# EAGLE design ATTiny_T1 (EAGLE 4.16)
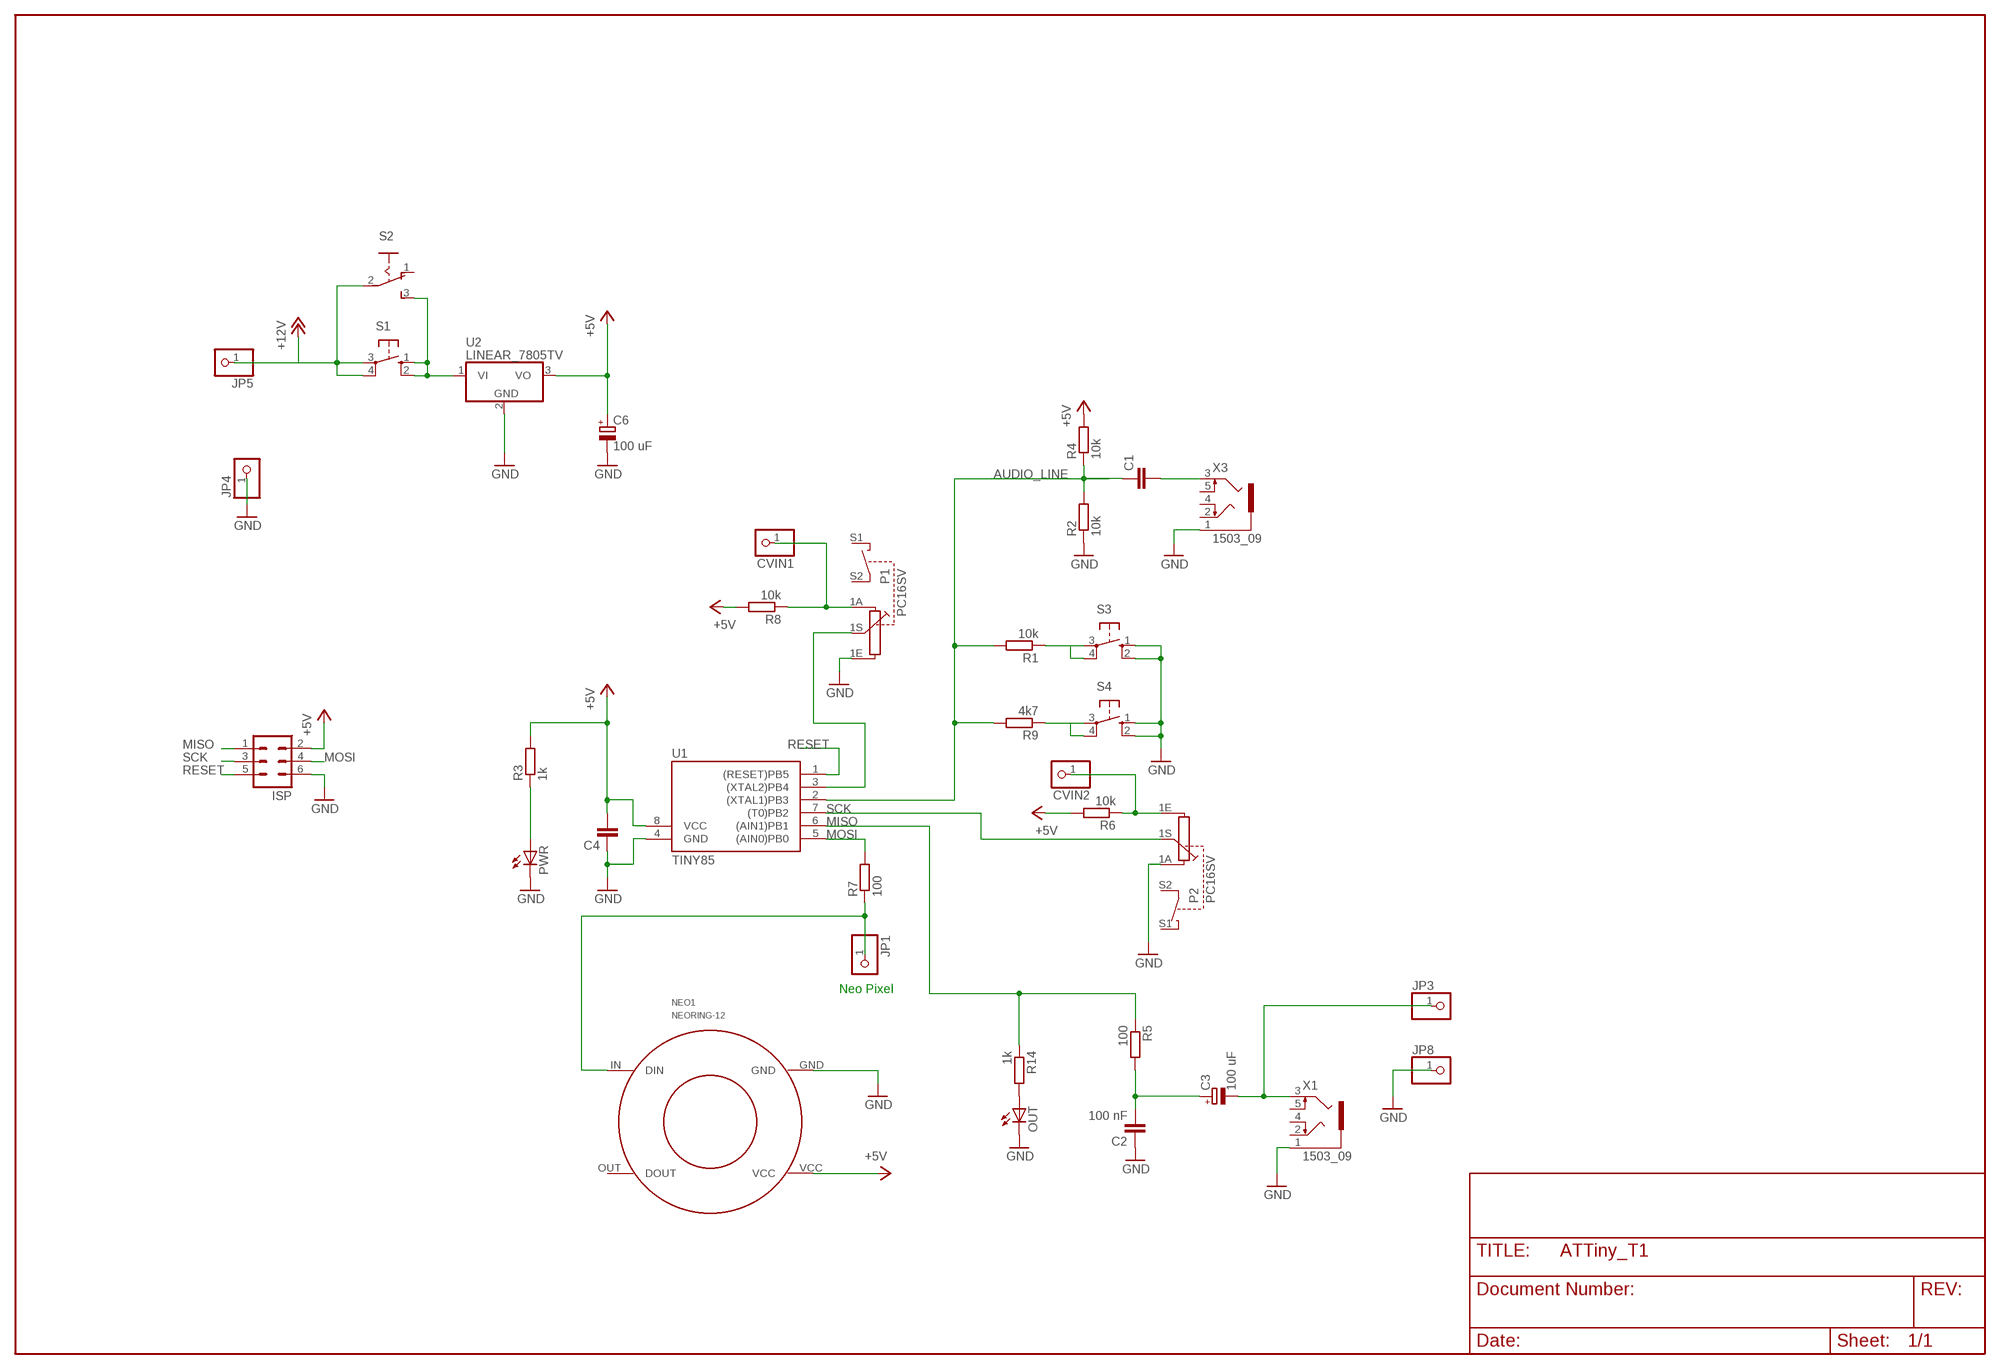
[diagram p0: schematic, sheet 1]

## Parts
C1  RCL_C-EU025-025X050  [RCL_C025-025X050]
C2  100 nF  RCL_C-EU025-025X050  [RCL_C025-025X050]
C3  100 uF  RCL_CPOL-EUE5-8.5  [RCL_E5-8,5]
C4  RCL_C-EU025-025X050  [RCL_C025-025X050]
C6  100 uF  RCL_CPOL-EUE5-8.5  [RCL_E5-8,5]
CVIN1  PINHEAD_PINHD-1X1  [PINHEAD_1X01]
CVIN2  PINHEAD_PINHD-1X1  [PINHEAD_1X01]
ISP  MA03-2  [MA03-2]
JP1  PINHEAD_PINHD-1X1  [PINHEAD_1X01]
JP3  PINHEAD_PINHD-1X1  [PINHEAD_1X01]
JP4  PINHEAD_PINHD-1X1  [PINHEAD_1X01]
JP5  PINHEAD_PINHD-1X1  [PINHEAD_1X01]
JP8  PINHEAD_PINHD-1X1  [PINHEAD_1X01]
NEO1  NEORING-12  [NEORING-12]
OUT  LED_LED3MM  [LED_LED3MM]
P1  PC16SV  [PC16SV]
P2  PC16SV  [PC16SV]
PWR  LED_LED3MM  [LED_LED3MM]
R1  10k  RCL_R-EU_0207/10  [RCL_0207/10]
R2  10k  RCL_R-EU_0207/10  [RCL_0207/10]
R3  1k  RCL_R-EU_0207/10  [RCL_0207/10]
R4  10k  RCL_R-EU_0207/10  [RCL_0207/10]
R5  100  RCL_R-EU_0207/10  [RCL_0207/10]
R6  10k  RCL_R-EU_0207/10  [RCL_0207/10]
R7  100  RCL_R-EU_0207/10  [RCL_0207/10]
R8  10k  RCL_R-EU_0207/10  [RCL_0207/10]
R9  4k7  RCL_R-EU_0207/10  [RCL_0207/10]
R14  1k  RCL_R-EU_0207/10  [RCL_0207/10]
S1  SWITCH-OMRON_10-XX  [SWITCH-OMRON_B3F-10XX]
S2  SWITCH_255SB  [SWITCH_255SB]
S3  SWITCH-OMRON_10-XX  [SWITCH-OMRON_B3F-10XX]
S4  SWITCH-OMRON_10-XX  [SWITCH-OMRON_B3F-10XX]
U1  TINY85  [DIL08]
U2  LINEAR_7805TV  [LINEAR_TO220V]
X1  1503_09  [1503_09]
X3  1503_09  [1503_09]

## Nets
+5V: C4.2 C6.+ ISP.2 NEO1.VCC R3.2 R4.2 R6.2 R8.2 U1.8(VCC) U2.3(VO)
+12V: JP5.1 S1.3(P) S1.4(P1) S2.2(P)
AUDIO_LINE: C1.1 R1.2 R2.2 R4.1 R9.2 U1.2((XTAL1)PB3)
CVIN1: CVIN2.1 P2.1E R6.1
CVIN2: CVIN1.1 P1.1A R8.1
GND: C2.1 C4.1 C6.- ISP.6 JP4.1 JP8.1 NEO1.GND OUT.K(C) P1.1E P2.1A PWR.K(C) R2.1 S3.1(S) S3.2(S1) S4.1(S) S4.2(S1) U1.4(GND) U2.2(GND) X1.1 X3.1
MISO: ISP.1 R5.1 R14.1 U1.6((AIN1)PB1)
MOSI: ISP.4 R7.2 U1.5((AIN0)PB0)
N$4: JP1.1 NEO1.IN(DIN) R7.1
N$6: R1.1 S3.3(P) S3.4(P1)
N$7: S1.1(S) S1.2(S1) S2.3(S) U2.1(VI)
N$8: R9.1 S4.3(P) S4.4(P1)
N$10: PWR.A R3.1
N$12: OUT.A R14.2
N$13: C2.2 C3.+ R5.2
N$14: C3.- JP3.1 X1.3
N$17: P1.1S U1.3((XTAL2)PB4)
N$22: C1.2 X3.3
RESET: ISP.5 U1.1((RESET)PB5)
SCK: ISP.3 P2.1S U1.7((T0)PB2)
Unconnected: NEO1.OUT(DOUT) P1.S1 P1.S2 P2.S1 P2.S2 S2.1(O) X1.2 X1.4 X1.5 X3.2 X3.4 X3.5

## Notes on the sheet
- Neo Pixel

## Library data of the parts
C1 C2 C4 = libarduinorobot:RCL_C-EU: CAPACITOR, European symbol
C3 C6 = libarduinorobot:RCL_CPOL-EU: POLARIZED CAPACITOR, European symbol
CVIN1 CVIN2 JP1 JP3-JP5 JP8 = libarduinorobot:PINHEAD_PINHD-1X1: PIN HEADER
ISP = con-lstb:MA03-2: PIN HEADER
NEO1 = NeoPixel:NEORING-12
OUT PWR = libarduinorobot:LED_LED: LED OSRAM: - CHIPLED LG R971, LG N971, LY N971, LG Q971, LY Q971, LO R971, LY R971 LH N974, LH R974 LS Q976, LO Q976, LY Q976 LO Q996 - Hyper CHIPLED LW Q18S LB Q993, LB Q99A, LB R99A - SideLED LS A670, LO A670, LY A670, LG A670, LP A670 LB A673, LV A673, LT A673, LW A673 LH A674 LY A675 LS A676, LA A676, LO A676, LY A676, LW A676 LS A679, LY A679, LG A679 - Hyper Micro SIDELED® LS Y876, LA Y876, LO Y876, LY Y876 LT Y87S - SmartLED LW L88C, LW L88S LB L89C, LB L89S, LG L890 LS L89K, LO L89K, LY L89K LS L896, LA L896, LO L896, LY L896 - TOPLED LS T670, LO T670, LY T670, LG T670, LP T670 LSG T670, LSP T670, LSY T670, LOP T670, LYG T670 LG T671, LOG T671, LSG T671 LB T673, LV T673, LT T673, LW T673 LH T674 LS T676, LA T676, LO T676, LY T676, LB T676, LH T676, LSB T676, LW T676 LB T67C, LV T67C, LT T67C, LS T67K, LO T67K, LY T67K, LW E67C LS E67B, LA E67B, LO E67B, LY E67B, LB E67C, LV E67C, LT E67C LW T67C LS T679, LY T679, LG T679 LS T770, LO T770, LY T770, LG T770, LP T770 LB T773, LV T773, LT T773, LW T773 LH T774 LS E675, LA E675, LY E675, LS T675 LS T776, LA T776, LO T776, LY T776, LB T776 LHGB T686 LT T68C, LB T68C - Hyper Mini TOPLED® LB M676 - Mini TOPLED Santana® LG M470 LS M47K, LO M47K, LY M47K Source: http://www.osram.convergy.de LUXEON: - LUMILED® LXK2-PW12-R00, LXK2-PW12-S00, LXK2-PW14-U00, LXK2-PW14-V00 LXK2-PM12-R00, LXK2-PM12-S00, LXK2-PM14-U00 LXK2-PE12-Q00, LXK2-PE12-R00, LXK2-PE12-S00, LXK2-PE14-T00, LXK2-PE14-U00 LXK2-PB12-K00, LXK2-PB12-L00, LXK2-PB12-M00, LXK2-PB14-N00, LXK2-PB14-P00, LXK2-PB14-Q00 LXK2-PR12-L00, LXK2-PR12-M00, LXK2-PR14-Q00, LXK2-PR14-R00 LXK2-PD12-Q00, LXK2-PD12-R00, LXK2-PD12-S00 LXK2-PH12-R00, LXK2-PH12-S00 LXK2-PL12-P00, LXK2-PL12-Q00, LXK2-PL12-R00 Source: www.luxeon.com KINGBRIGHT: KA-3528ASYC Source: www.kingbright.com
P1 P2 = piher:PC16SV: POTENTIOMETER vertical single carbon potentiometer with switch, 16 mm
R1-R9 R14 = libarduinorobot:RCL_R-EU_: RESISTOR, European symbol
S1 S3 S4 = libarduinorobot:SWITCH-OMRON_10-XX: OMRON SWITCH
S2 = libarduinorobot:SWITCH_255SB: SLIDING SWITCH Distributor Buerklin, 11G810
U1 = atmel:TINY85
U2 = libarduinorobot:LINEAR_78*: Positive VOLTAGE REGULATOR Source: http://cache.national.com/ds/LM/LM78L05.pdf http://www.fairchildsemi.com/ds/LM/LM7805.pdf
X1 X3 = con-lumberg:1503_09: Jack connectors according to JISC 6560, 3.5 mm Klinkeneinbaukupplung nach JISC 6560, 3,5 mm, 3-polig/ stereo, abgewinkelte Ausführung, mit 2 Öffnern und Lötaugen, für Leiterplatten Rückseitenmontage Source: http://www.lumberg.com/Produkte/PDFs/1503_09.pdf

## Board
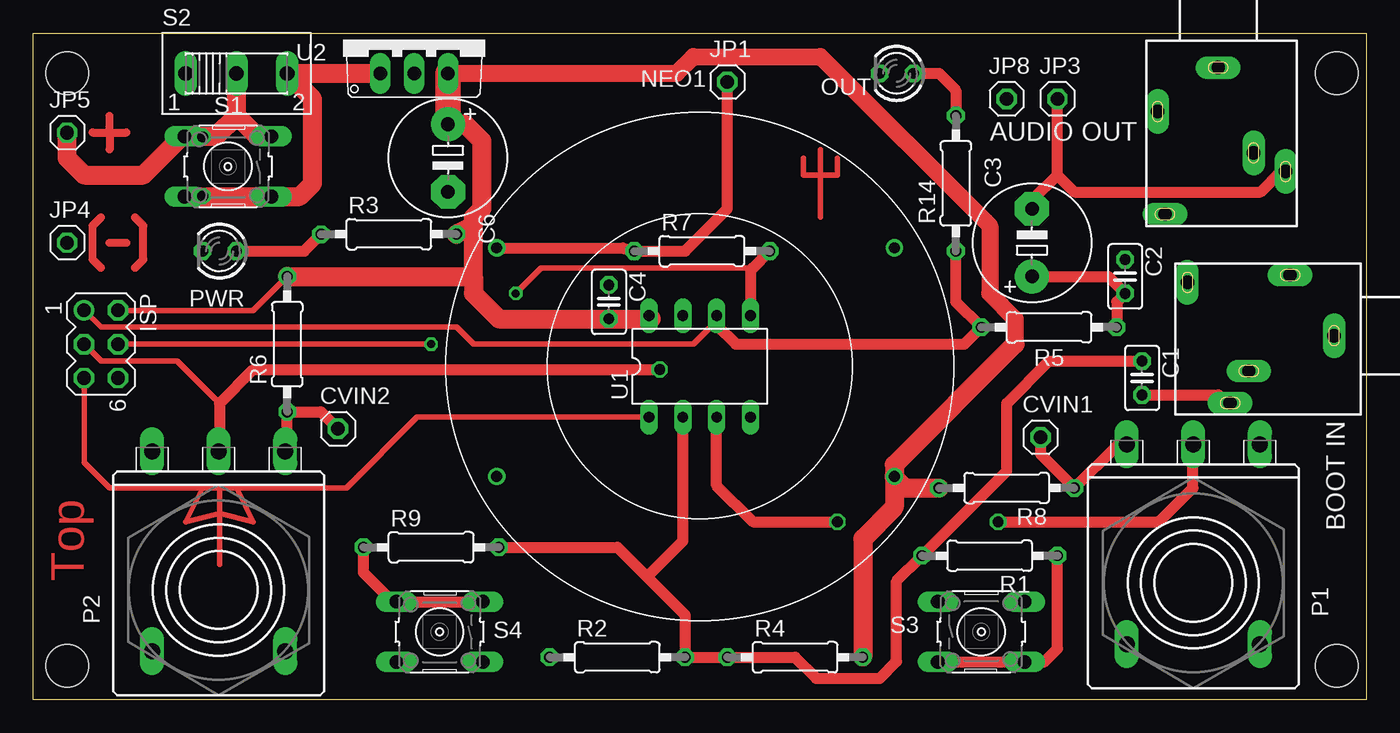
[diagram p1: board, top side]
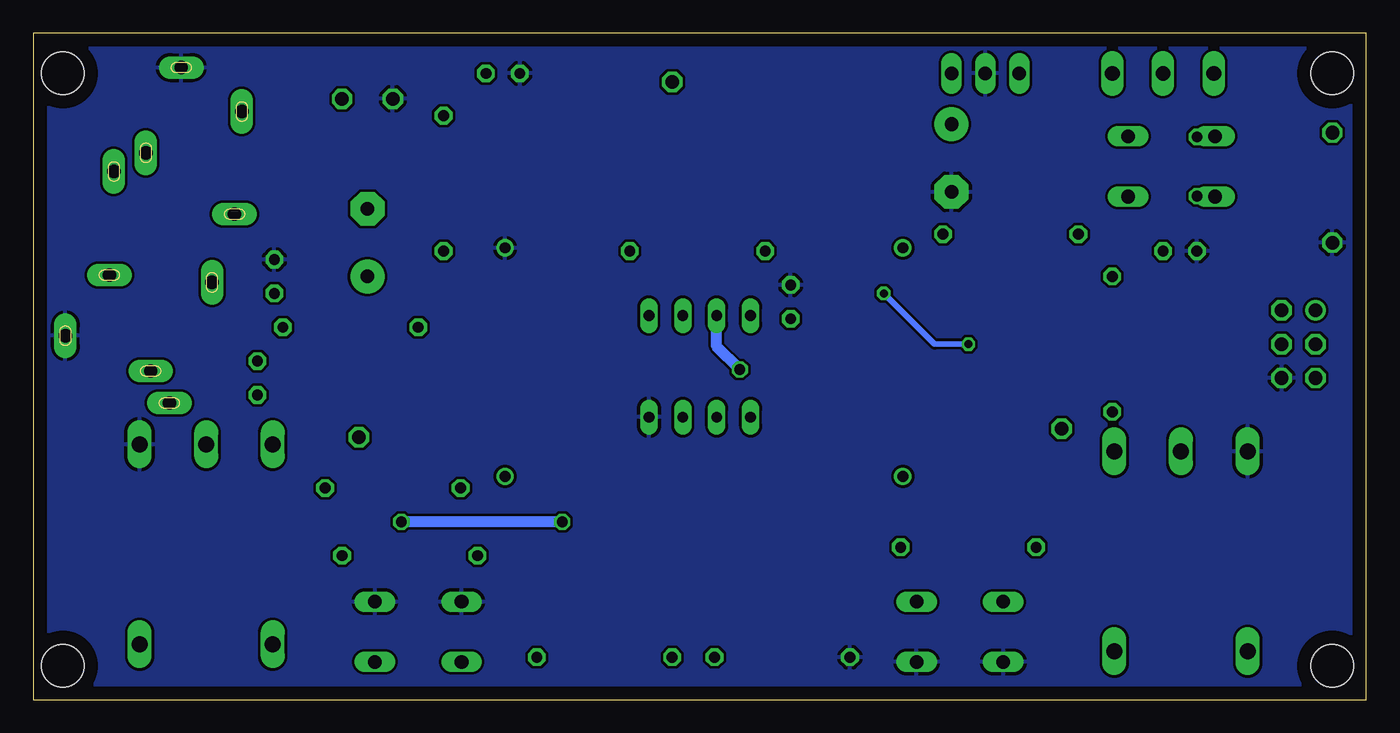
[diagram p2: board, bottom side, seen from below]

Size 100 x 50 mm. Coordinates in mm from the lower left corner, seen from the top.
Outline: 0,0 0,50 100,50 100,0 0,0
Copper layers (1+16): Top 0.035mm / dielectric 1.5mm / Bottom 0.035mm
Design rules "dru0_2mm": minimum track width 0.2mm, minimum drill 0.3mm, track to track 0.2mm, track to pad 0.2mm, pad to pad 0.2mm, via to via 0.2mm, smd to smd 0mil, copper to edge 40mil, drill to drill 8mil, minimum pad ring 10mil, minimum via ring 8mil, stop-mask expansion 4mil, vias tented up to drill 0mil, thermal gap 10mil
Holes 3.2 mm at 2.54,2.54 97.79,2.54 97.79,46.99 2.54,46.99

### Footprints (pad centres in the part's own frame; a part is rotated, then mirrored left to right if it is on the bottom)
RCL_C025-025X050 = drill 0.813 octagon: 1 -1.27,0; 2 1.27,0
RCL_E5-8,5 = drill 1.016 pad 2.54 round: + -2.54,0 | drill 1.016 pad 2.54 octagon: - 2.54,0
PINHEAD_1X01 = drill 1.016 octagon: 1 0,0
MA03-2 = drill 1.016 round: 1 -2.54,-1.27 | drill 1.016 octagon: 2 -2.54,1.27; 3 0,-1.27; 4 0,1.27; 5 2.54,-1.27; 6 2.54,1.27
NEORING-12 = drill 0.8 round: GND 14.605,8.89; IN -15.24,8.89; OUT -15.24,-8.255; VCC 14.605,-8.255
LED_LED3MM = drill 0.813 octagon: A -1.27,0; K 1.27,0
PC16SV = drill 1.2 long: 1A -5,10.4; 1E 5,10.4; 1S 0,10.4; S1 -5,-4.6; S2 5,-4.6
RCL_0207/10 = drill 0.813 octagon: 1 -5.08,0; 2 5.08,0
SWITCH-OMRON_B3F-10XX = drill 1.016 long: 1 -3.251,2.261; 2 3.251,2.261; 3 -3.251,-2.261; 4 3.251,-2.261
SWITCH_255SB = drill 1.118 long: 1 -3.81,0; 2 0,0; 3 3.81,0
DIL08 = drill 0.813 long: 1 -3.81,-3.81; 2 -1.27,-3.81; 3 1.27,-3.81; 4 3.81,-3.81; 5 3.81,3.81; 6 1.27,3.81; 7 -1.27,3.81; 8 -3.81,3.81
LINEAR_TO220V = drill 1.016 long: 1 -2.54,-2.54; 2 0,-2.54; 3 2.54,-2.54
1503_09 = drill 1 pad 1.676 long: 1 0,-2.1; 2 -4.55,-5.4; 3 5.05,-9.9; 4 -4,-13.1; 5 2.65,-8.5

### Placement (x,y rotation side)
C1  83.19,24.13 270 top
C2  81.92,31.75 270 top
C3  74.93,34.29 90 top
C4  43.18,29.84 270 top
C6  31.11,40.64 270 top
CVIN1  75.56,19.68 0 top
CVIN2  22.86,20.32 0 top
ISP  5.08,26.67 270 top
JP1  52.07,46.35 0 top
JP3  76.83,45.09 0 top
JP4  2.54,34.29 0 top
JP5  2.54,42.55 0 top
JP8  73.03,45.09 0 top
NEO1  50,25 0 top
OUT  64.77,46.99 180 top
P1  87.03,8.76 0 top
P2  13.9,8.22 0 top
PWR  13.97,33.66 180 top
R1  71.75,10.79 180 top
R2  43.81,3.17 0 top
R3  26.67,34.92 0 top
R4  57.15,3.17 0 top
R5  76.2,27.94 0 top
R6  19.05,26.67 90 top
R7  50.16,33.66 0 top
R8  73.03,15.88 180 top
R9  29.84,11.43 0 top
R14  69.22,38.73 90 top
S1  14.61,40.01 180 top
S2  15.24,46.99 0 top
S3  71.12,5.08 0 top
S4  30.48,5.08 180 top
U1  50,25 0 top
U2  28.57,49.53 0 top
X1  88.9,49.53 0 top
X3  99.69,27.3 270 top

### Tracks (layer width: path | path; a pad name or v marks a point on that pad's centre or on a via)
+5V
  Top 0.406: ISP.2 16.51,29.21 R6.2
  Top 1.27: U2.3 48.26,46.99 49.53,48.26 59.05,48.26 71.75,35.56 71.75,30.48 73.66,28.57 73.66,26.67
  Top 1.422: 33.02,31.75 33.02,30.48 34.92,28.57 C4.2 46.35,28.57 46.19,28.74 U1.8 | 33.02,31.75 33.02,35.56 | 33.02,35.56 33.02,36.2 33.66,36.83 33.66,41.91 32.38,43.18 C6.+ | NEO1.VCC 64.61,14.44 62.23,12.06 R4.2 | NEO1.VCC 64.61,17.61 73.66,26.67 | NEO1.VCC 64.61,16.68 65.41,15.88 R8.2 | R6.2 33.02,31.75 | 33.02,35.56 R3.2
  Top 1.93: C6.+ U2.3
+12V  (via drill 0.8)
  Top 0.305: 13.65,42.27 13.65,42.23 v12.7,42.23
  Top 1.422: JP5.1 2.54,40.64 3.81,39.37 8.26,39.37 11.15,42.27 S1.4 13.65,42.27 13.69,42.27 15.24,43.81 | 15.24,43.81 S2.2 | S1.3 16.79,42.27 15.24,43.81
AUDIO_LINE
  Top 0.813: R9.2 43.81,11.43 46.04,9.21 | 46.04,9.21 48.9,6.35 R2.2 R4.1 57.15,3.17 58.74,1.59 63.5,1.59 64.77,2.86 64.77,8.89 R1.2 73.03,17.14 73.03,22.23 76.2,25.4 C1.1 | U1.2 48.73,11.9 46.04,9.21
CVIN1
  Top 0.813: 18.9,18.57 P2.1E 18.9,18.9 19.05,19.05 R6.1 21.59,21.59 CVIN2.1
CVIN2
  Top 0.813: P1.1A 81.39,19.16 R8.1 75.56,18.41 CVIN1.1
GND
  pour Bottom: 0.64,49.53 0.64,0.64 99.69,0.64 99.69,49.53
MISO
  Top 0.406: ISP.1 5.08,27.94 31.75,27.94 33.02,26.67 49.53,26.67 50.97,28.11 51.27,28.11 | 51.44,28.57 51.27,28.74 U1.6
  Top 0.813: U1.6 51.27,28.11 52.7,26.67 69.85,26.67 R5.1 69.22,29.84 R14.1
MOSI  (via drill 0.6)
  Top 0.406: ISP.4 v29.84,26.67 | 53.98,32.38 38.1,32.38 v36.2,30.48
  Top 0.813: U1.5 53.81,32.22 53.98,32.38 R7.2
  Bottom 0.406: v29.84,26.67 32.38,26.67 v36.2,30.48
N$1
  Top 0.406: 59.05,39.37 59.05,41.27 | 59.05,39.37 57.78,39.37 57.78,40.64 | 59.05,39.37 60.33,39.37 60.33,40.64 | 59.05,36.2 59.05,39.37
N$4
  Top 0.813: NEO1.IN 44.22,33.89 R7.1 48.9,33.66 52.07,36.83 JP1.1
N$6
  Top 0.813: R1.1 76.83,3.81 75.84,2.82 S3.4 74.37,2.62 74.3,2.54 74.02,2.82 S3.3
N$7  (via drill 0.8)
  Top 0.305: S1.2 11.39,37.74 11.43,37.78 v12.7,37.78
  Top 1.422: U2.1 S2.3 20.95,45.09 20.95,38.73 19.96,37.74 S1.1 17.5,37.74 17.14,37.78 16.79,37.74 S1.2
N$8
  Top 0.813: R9.1 24.77,9.53 26.95,7.34 S4.4 33.38,7.34 33.66,7.62 33.73,7.54 S4.3
N$10
  Top 0.813: PWR.A 20.32,33.66 R3.1
N$12
  Top 0.813: R14.2 69.22,45.72 67.94,46.99 OUT.A
N$13
  Top 0.813: R5.2 81.28,29.84 C2.2 80.64,31.75 C3.+
N$14
  Top 0.813: C3.- 74.93,37.47 76.83,39.37 | 76.83,39.37 JP3.1 | 76.83,39.37 78.11,38.1 92.08,38.1 93.61,39.63 X1.3
N$15
  Top 0.61: 4.45,42.55 5.71,42.55 | 5.71,42.55 6.99,42.55 | 5.71,42.55 5.71,43.81 | 5.71,42.55 5.71,41.27
N$17  (via drill 0.8)
  Top 0.813: U1.3 51.27,16.04 53.98,13.34 v60.33,13.34 | v72.39,13.34 84.45,13.34 87,15.88 87,19.05 87.03,19.09 P1.1S
  Bottom 0.813: v60.33,13.34 v72.39,13.34
N$19
  Top 0.61: 5.08,36.2 4.45,35.56 4.45,33.02 5.08,32.38
N$22
  Top 0.813: C1.2 88.9,22.86 89.5,22.25 X3.3
N$23
  Top 0.61: 5.71,34.29 6.99,34.29
N$24
  Top 0.61: 7.62,36.2 8.26,35.56 8.26,33.02 7.62,32.38
RESET
  Top 0.406: U1.1 28.81,21.19 23.5,15.88 15.24,15.88 | 12.7,15.88 5.71,15.88 3.81,17.78 ISP.5 | 12.7,15.88 13.97,15.88 | 13.97,15.88 15.24,15.88 | 13.97,15.88 13.97,13.97 | 13.97,13.97 13.97,10.16 | 12.7,15.88 11.43,13.34 13.97,13.97 | 13.97,13.97 16.51,13.34 15.24,15.88
SCK  (via drill 0.8)
  Top 0.406: ISP.3 5.08,25.4 10.79,25.4 13.97,22.23
  Top 0.813: v46.99,24.77 16.51,24.77 13.97,22.23 13.97,19.05 13.9,18.48 P2.1S
  Bottom 0.813: U1.7 48.73,26.5 v46.99,24.77

### Text on the board
Top: Top
tNames: AUDIO OUT | BOOT IN